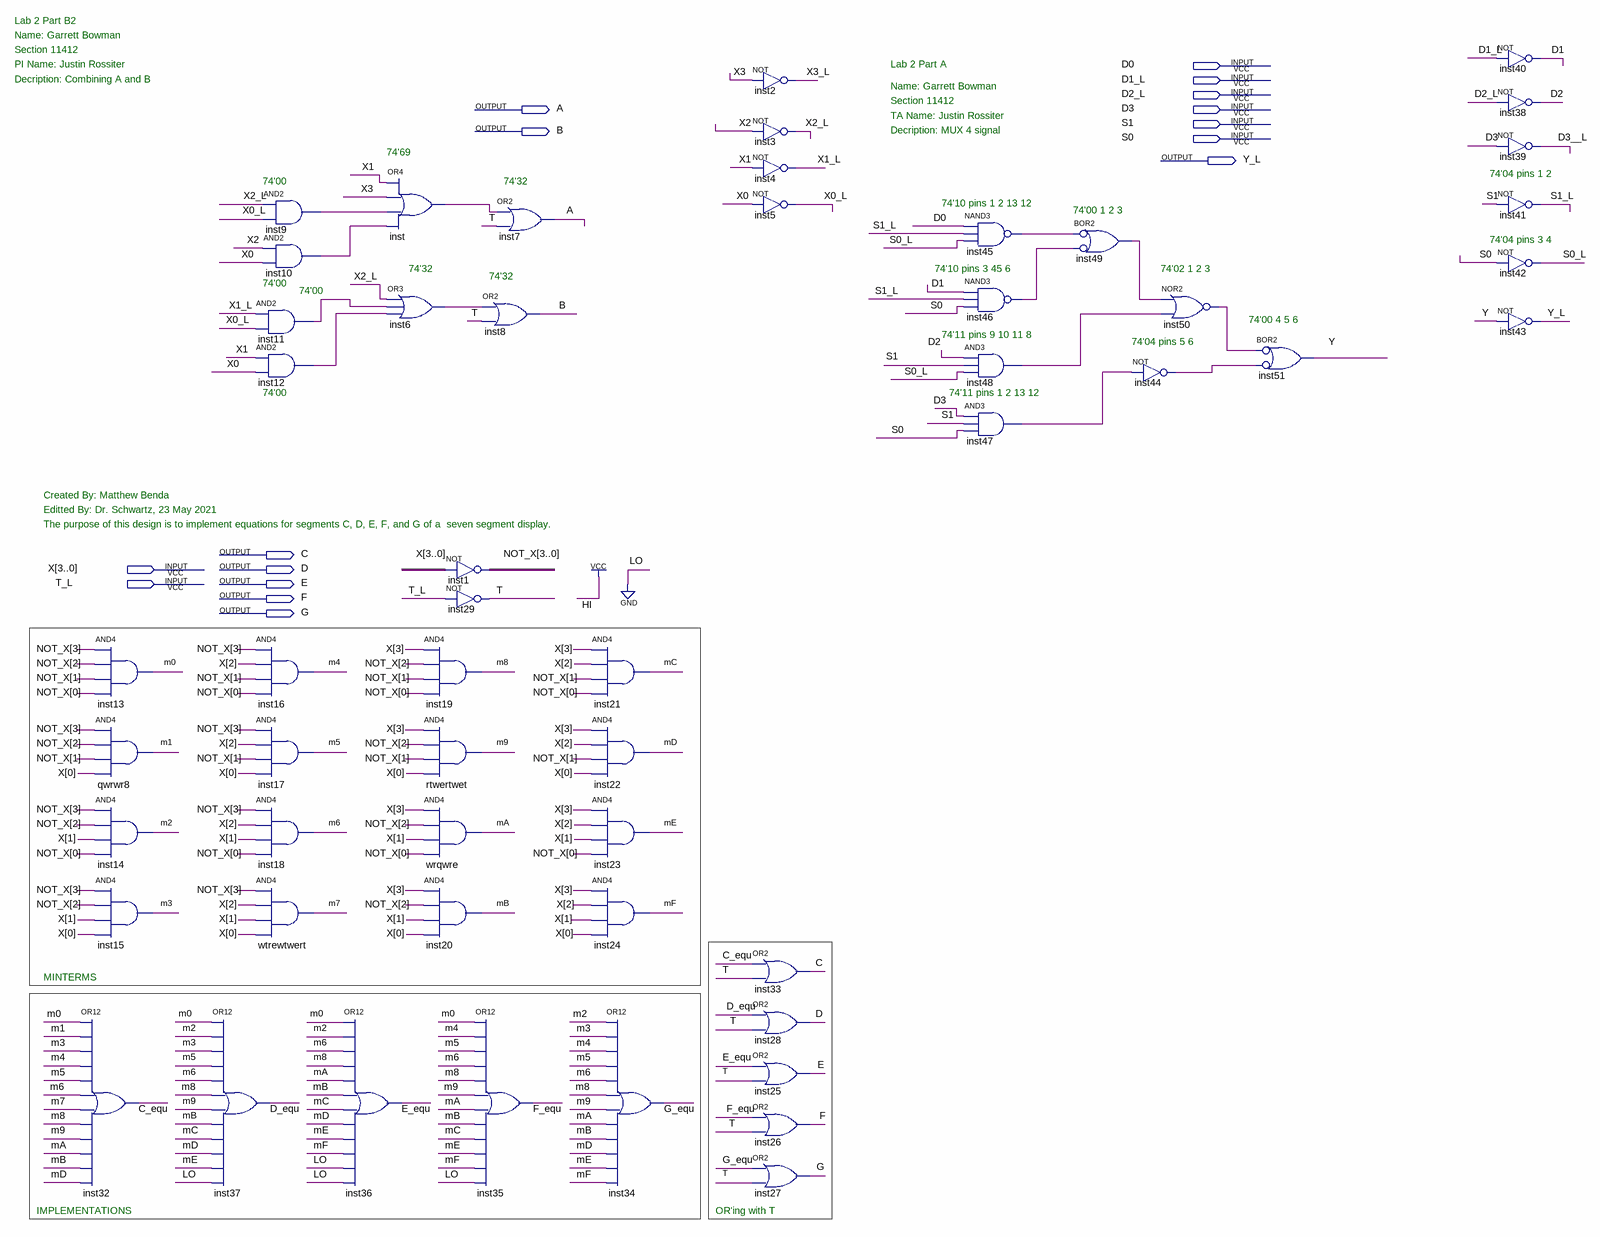
[diagram p0: schematic sheet]
// Quartus schematic Lab2_combined.bdf as structural Verilog: 54 symbols, 16 pins
module Lab2_combined (
  input  D0,
  input  D1_L,
  input  D2_L,
  input  D3,
  input  S1,
  input  S0,
  input  [3:0] X,
  input  T_L,
  output A,
  output B,
  output Y_L,
  output C,
  output D,
  output E,
  output F,
  output G
);

  wire C_equ, D1, D2, D3__L, D_equ, E_equ, F_equ, G_equ, inst6_out, inst9_out, inst10_out, inst11_out,
       inst12_out, inst44_out, inst45_out, inst46_out, inst47_out, inst48_out, inst49_out, inst50_out,
       inst_out, m0, m1, m2, m3, m4, m5, m6, m7, m8, m9, mA, mB, mC, mD, mE, mF, S0_L, S1_L, T, X0_L, X1_L,
       X2_L, X3_L, Y;
  wire [3:0] NOT_X;

  and inst13 (m0, NOT_X[3], NOT_X[2], NOT_X[1], NOT_X[0]);
  and qwrwr8 (m1, NOT_X[3], NOT_X[2], NOT_X[1], X[0]);
  and inst14 (m2, NOT_X[3], NOT_X[2], X[1], NOT_X[0]);
  and inst15 (m3, NOT_X[3], NOT_X[2], X[1], X[0]);
  or inst32 (C_equ, m0, m1, m3, m4, m5, m6, m7, m8, m9, mA, mB, mD);
  or inst37 (D_equ, m0, m2, m3, m5, m6, m8, m9, mB, mC, mD, mE, 1'b0);
  and inst9 (inst9_out, X2_L, X0_L);
  and inst10 (inst10_out, X[2], X[0]);
  and inst11 (inst11_out, X1_L, X0_L);
  and inst12 (inst12_out, X[1], X[0]);
  and inst16 (m4, NOT_X[3], X[2], NOT_X[1], NOT_X[0]);
  and inst17 (m5, NOT_X[3], X[2], NOT_X[1], X[0]);
  and inst18 (m6, NOT_X[3], X[2], X[1], NOT_X[0]);
  and wtrewtwert (m7, NOT_X[3], X[2], X[1], X[0]);
  or inst (inst_out, X[1], X[3], inst9_out, inst10_out);
  or inst6 (inst6_out, X2_L, inst11_out, inst12_out);
  or inst36 (E_equ, m0, m2, m6, m8, mA, mB, mC, mD, mE, mF, 1'b0, 1'b0);
  assign NOT_X = ~X;  // NOT inst1, 4 bits wide
  not inst29 (T, T_L);
  and inst19 (m8, X[3], NOT_X[2], NOT_X[1], NOT_X[0]);
  and rtwertwet (m9, X[3], NOT_X[2], NOT_X[1], X[0]);
  and wrqwre (mA, X[3], NOT_X[2], X[1], NOT_X[0]);
  and inst20 (mB, X[3], NOT_X[2], X[1], X[0]);
  or inst7 (A, inst_out, T);
  or inst8 (B, inst6_out, T);
  or inst35 (F_equ, m0, m4, m5, m6, m8, m9, mA, mB, mC, mE, mF, 1'b0);
  and inst21 (mC, X[3], X[2], NOT_X[1], NOT_X[0]);
  and inst22 (mD, X[3], X[2], NOT_X[1], X[0]);
  and inst23 (mE, X[3], X[2], X[1], NOT_X[0]);
  and inst24 (mF, X[3], X[2], X[1], X[0]);
  or inst34 (G_equ, m2, m3, m4, m5, m6, m8, m9, mA, mB, mD, mE, mF);
  not inst2 (X3_L, X[3]);
  not inst3 (X2_L, X[2]);
  not inst4 (X1_L, X[1]);
  not inst5 (X0_L, X[0]);
  or inst33 (C, C_equ, T);
  or inst28 (D, D_equ, T);
  or inst25 (E, E_equ, T);
  or inst26 (F, F_equ, T);
  or inst27 (G, G_equ, T);
  nand inst45 (inst45_out, D0, S1_L, S0_L);
  nand inst46 (inst46_out, D1, S1_L, S0);
  and inst48 (inst48_out, D2, S1, S0_L);
  and inst47 (inst47_out, D3, S1, S0);
  or inst49 (inst49_out, ~inst45_out, ~inst46_out);  // BOR2
  not inst44 (inst44_out, inst47_out);
  nor inst50 (inst50_out, inst49_out, inst48_out);
  or inst51 (Y, ~inst50_out, ~inst44_out);  // BOR2
  not inst40 (D1, D1_L);
  not inst38 (D2, D2_L);
  not inst39 (D3__L, D3);
  not inst41 (S1_L, S1);
  not inst42 (S0_L, S0);
  not inst43 (Y_L, Y);

  // Notes on the sheet:
  //   Lab 2 Part B2
  //   Name: Garrett Bowman
  //   Section 11412
  //   PI Name: Justin Rossiter
  //   Lab 2 Part A
  //   Decription: Combining A and B
  //   Name: Garrett Bowman
  //   Section 11412
  //   TA Name: Justin Rossiter
  //   Decription: MUX 4 signal
  //   74'69
  //   74'04 pins 1 2
  //   74'00
  //   74'32
  //   74'10 pins 1 2 13 12
  //   74'00 1 2 3
  //   74'04 pins 3 4
  //   74'32
  //   74'10 pins 3 45 6
  //   74'02 1 2 3
  //   74'32
  //   74'00
  //   74'00
  //   74'00 4 5 6
  //   74'11 pins 9 10 11 8
  //   74'04 pins 5 6
  //   74'00
  //   74'11 pins 1 2 13 12
  //   Created By: Matthew Benda
  //   Editted By: Dr. Schwartz, 23 May 2021
  //   The purpose of this design is to implement equations for segments C, D, E, F, and G of a  seven segment display.            
  //   MINTERMS
  //   IMPLEMENTATIONS
  //   OR'ing with T
endmodule
